# Altium schematic sheet USBC_A.SchDoc: DARKYDEN_USBC_A (part 1 of 2)
size Letter; ApprovedBy: APPROUVÉ PAR; Author: Harold Malbrouck; Organization: Cegep Limoilou; Address1: 1300, 8e Avenue; Address2: Québec, QC; Address3: Canada; Address4: G1J 5L5; Revision: Rev.E; SheetNumber: 7; SheetTotal: 21
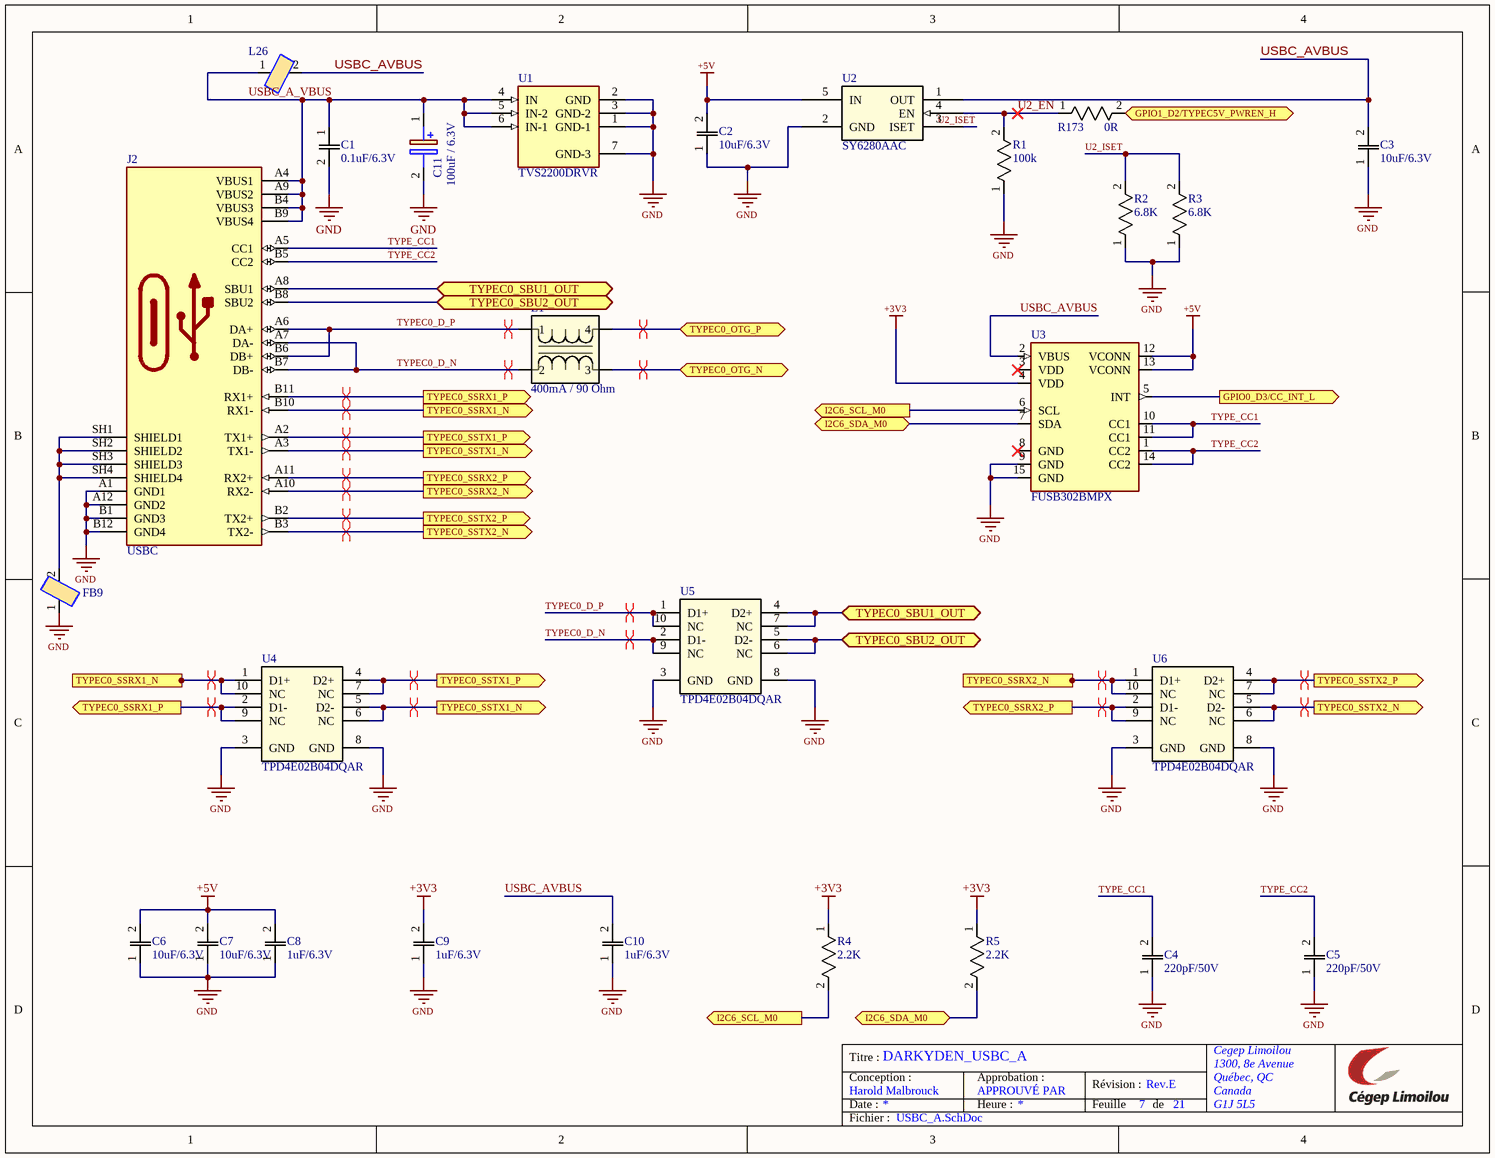
[diagram p0: USBC_A.SchDoc]

## Parts
C1  0.1uF/6.3V  [C0805]
C2  10uF/6.3V  [C0805]
C3  10uF/6.3V  [C0805]
C4  220pF/50V  [C0805]
C5  220pF/50V  [C0805]
C6  10uF/6.3V  [C0805]
C7  10uF/6.3V  [C0805]
C8  1uF/6.3V  [C0805]
C9  1uF/6.3V  [C0805]
C10  1uF/6.3V  [C0805]
C11  100uF / 6.3V  [EEE0GA101SR]
FB9  220R / 100MHz  [BLM18SP221SN1B]  (value not drawn)
J2  USBC  [USB_C]
L1  400mA / 90 Ohm  [ACM20129002PT002]
L26  FBMJ2125HM210NT  [INDC2012X105N]  (value not drawn)
R1  100k  [RESC1608X55N]
R2  6.8K  [RESC1608X55N]
R3  6.8K  [RESC1608X55N]
R4  2.2K  [RESC1608X55N]
R5  2.2K  [RESC1608X55N]
R173  0R  [RESC1608X55N]
U1  TVS2200DRVR  [SON65P200X200X80-7N]
U2  SY6280AAC  [SOT95P285X140-5N]
U3  FUSB302BMPX  [QFN50P250X250X80-15N]
U4  TPD4E02B04DQAR  [DQA0010A]
U5  TPD4E02B04DQAR  [DQA0010A]
U6  TPD4E02B04DQAR  [DQA0010A]

## Ports
GPIO0_D3/CC_INT_L (out, see CONNECTEUR_3[3B]), GPIO1_D2/TYPEC5V_PWREN_H (bidir, see CONNECTEUR_3[1B]), I2C6_SCL_M0 (out, see CONNECTEUR_3[3C], USBC_A[2D]), I2C6_SCL_M0 (out, see CONNECTEUR_3[3C], USBC_A[3B]), I2C6_SDA_M0 (bidir, see CONNECTEUR_3[3C], USBC_A[3B]), I2C6_SDA_M0 (bidir, see CONNECTEUR_3[3C], USBC_A[3D]), TYPEC0_OTG_N (bidir, see CONNECTEUR_2[3C]), TYPEC0_OTG_P (bidir, see CONNECTEUR_2[3C]), TYPEC0_SBU1_OUT (bidir, see CONNECTEUR_4[3A], USBC_A[2A]), TYPEC0_SBU1_OUT (bidir, see CONNECTEUR_4[3A], USBC_A[3C]), TYPEC0_SBU2_OUT (bidir, see CONNECTEUR_4[3A], USBC_A[2B]), TYPEC0_SBU2_OUT (bidir, see CONNECTEUR_4[3A], USBC_A[3C]), TYPEC0_SSRX1_N (out, see CONNECTEUR_2[1C], USBC_A[1C]), TYPEC0_SSRX1_N (out, see CONNECTEUR_2[1C], USBC_A[2B]), TYPEC0_SSRX1_P (out, see CONNECTEUR_2[1C], USBC_A[1C]), TYPEC0_SSRX1_P (out, see CONNECTEUR_2[1C], USBC_A[2B]), TYPEC0_SSRX2_N (out, see CONNECTEUR_2[1C], USBC_A[2B]), TYPEC0_SSRX2_N (out, see CONNECTEUR_2[1C], USBC_A[3C]), TYPEC0_SSRX2_P (out, see CONNECTEUR_2[1C], USBC_A[2B]), TYPEC0_SSRX2_P (out, see CONNECTEUR_2[1C], USBC_A[3C]), TYPEC0_SSTX1_N (out, see CONNECTEUR_2[1C], USBC_A[2B]), TYPEC0_SSTX1_N (out, see CONNECTEUR_2[1C], USBC_A[2C]), TYPEC0_SSTX1_P (out, see CONNECTEUR_2[1C], USBC_A[2B]), TYPEC0_SSTX1_P (out, see CONNECTEUR_2[1C], USBC_A[2C]), TYPEC0_SSTX2_N (out, see CONNECTEUR_2[1B], USBC_A[2B]), TYPEC0_SSTX2_N (out, see CONNECTEUR_2[1B], USBC_A[4C]), TYPEC0_SSTX2_P (out, see CONNECTEUR_2[1B], USBC_A[2B]), TYPEC0_SSTX2_P (out, see CONNECTEUR_2[1B], USBC_A[4C])

## Nets
+3V3: C9.2 R4.1 R5.1 U3.4(VDD)
+5V: C2.2 C6.2 C7.2 C8.2 U2.5(IN) U3.12(VCONN) U3.13(VCONN)
GND: C1.2 C2.1 C3.1 C4.1 C5.1 C6.1 C7.1 C8.1 C9.1 C10.1 C11.2(-) FB9.1 J2.A1(GND1) J2.A12(GND2) J2.B1(GND3) J2.B12(GND4) R1.1 R2.1 R3.1 U1.1(GND-1) U1.2(GND) U1.3(GND-2) U1.7(GND-3) U2.2(GND) U3.9(GND) U3.15(GND) U4.3(GND) U4.8(GND) U5.3(GND) U5.8(GND) U6.3(GND) U6.8(GND)
GPIO0_D3/CC_INT_L: U3.5(INT) ; port GPIO0_D3/CC_INT_L
GPIO1_D2/TYPEC5V_PWREN_H: R173.2 ; port GPIO1_D2/TYPEC5V_PWREN_H
I2C6_SCL_M0: R4.2 U3.6(SCL) ; port I2C6_SCL_M0
I2C6_SDA_M0: R5.2 U3.7(SDA) ; port I2C6_SDA_M0
TYPE_CC1: C4.2 J2.A5(CC1) U3.10(CC1) U3.11(CC1)
TYPE_CC2: C5.2 J2.B5(CC2) U3.1(CC2) U3.14(CC2)
TYPEC0_D_N: J2.A7(DA-) J2.B7(DB-) L1.2 U5.2(D1-) U5.9(NC)
TYPEC0_D_P: J2.A6(DA+) J2.B6(DB+) L1.1 U5.1(D1+) U5.10(NC)
TYPEC0_OTG_N: L1.3 ; port TYPEC0_OTG_N
TYPEC0_OTG_P: L1.4 ; port TYPEC0_OTG_P
TYPEC0_SBU1_OUT: J2.A8(SBU1) U5.4(D2+) U5.7(NC) ; port TYPEC0_SBU1_OUT
TYPEC0_SBU2_OUT: J2.B8(SBU2) U5.5(D2-) U5.6(NC) ; port TYPEC0_SBU2_OUT
TYPEC0_SSRX1_N: J2.B10(RX1-) U4.1(D1+) U4.10(NC) ; port TYPEC0_SSRX1_N
TYPEC0_SSRX1_P: J2.B11(RX1+) U4.2(D1-) U4.9(NC) ; port TYPEC0_SSRX1_P
TYPEC0_SSRX2_N: J2.A10(RX2-) U6.1(D1+) U6.10(NC) ; port TYPEC0_SSRX2_N
TYPEC0_SSRX2_P: J2.A11(RX2+) U6.2(D1-) U6.9(NC) ; port TYPEC0_SSRX2_P
TYPEC0_SSTX1_N: J2.A3(TX1-) U4.5(D2-) U4.6(NC) ; port TYPEC0_SSTX1_N
TYPEC0_SSTX1_P: J2.A2(TX1+) U4.4(D2+) U4.7(NC) ; port TYPEC0_SSTX1_P
TYPEC0_SSTX2_N: J2.B3(TX2-) U6.5(D2-) U6.6(NC) ; port TYPEC0_SSTX2_N
TYPEC0_SSTX2_P: J2.B2(TX2+) U6.4(D2+) U6.7(NC) ; port TYPEC0_SSTX2_P
U2_EN: R1.2 R173.1 U2.4(EN)
U2_ISET: R2.2 R3.2 U2.3(ISET)
USBC_A_VBUS: C1.1 C11.1(+) J2.A4(VBUS1) J2.A9(VBUS2) J2.B4(VBUS3) J2.B9(VBUS4) L26.1 U1.4(IN) U1.5(IN-2) U1.6(IN-1)
USBC_AVBUS: C3.2 C10.2 L26.2 U2.1(OUT) U3.2(VBUS)
NetFB9_2: FB9.2 J2.SH1(SHIELD1) J2.SH2(SHIELD2) J2.SH3(SHIELD3) J2.SH4(SHIELD4)

Not connected (* = marked no-connect by the designer): U3 3(VDD)* 8(GND)*

## Layout directives
differential pair; differential pair class USBC_A: TYPEC0_D_N, TYPEC0_D_P, TYPEC0_OTG_N, TYPEC0_OTG_P, TYPEC0_SSRX1_N, TYPEC0_SSRX1_P, TYPEC0_SSRX2_N, TYPEC0_SSRX2_P, TYPEC0_SSTX1_N, TYPEC0_SSTX1_P, TYPEC0_SSTX2_N, TYPEC0_SSTX2_P
differential pair: TYPEC0_D_P

## Notes on the sheet
- Titre :
- Conception :
- Date :
- Approbation :
- Heure :
- Révision :
- Feuille
- de
- Fichier :